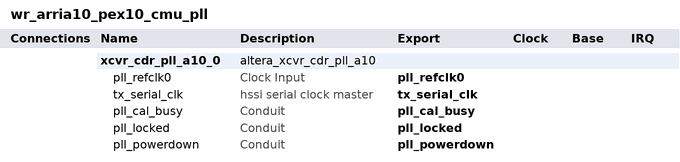
[diagram p0: system contents]
# Platform Designer (Qsys) system wr_arria10_pex10_cmu_pll, Arria 10 10AX027H2F34E2SG
# Parameters at their usual value, and those the tool derives, are not listed.
package require -exact qsys 18.1
create_system wr_arria10_pex10_cmu_pll
set_project_property DEVICE_FAMILY {Arria 10}
set_project_property DEVICE 10AX027H2F34E2SG

add_instance xcvr_cdr_pll_a10_0 altera_xcvr_cdr_pll_a10 18.1
set_instance_property xcvr_cdr_pll_a10_0 AUTO_EXPORT true
set_instance_parameter_value xcvr_cdr_pll_a10_0 base_device NIGHTFURY2
set_instance_parameter_value xcvr_cdr_pll_a10_0 bw_sel Medium
set_instance_parameter_value xcvr_cdr_pll_a10_0 cdr_pll_cgb_div 1
set_instance_parameter_value xcvr_cdr_pll_a10_0 cdr_pll_initial_settings true
set_instance_parameter_value xcvr_cdr_pll_a10_0 cdr_pll_is_cascaded_pll false
set_instance_parameter_value xcvr_cdr_pll_a10_0 cdr_pll_optimal false
set_instance_parameter_value xcvr_cdr_pll_a10_0 device_family {Arria 10}
set_instance_parameter_value xcvr_cdr_pll_a10_0 enable_analog_resets 0
set_instance_parameter_value xcvr_cdr_pll_a10_0 enable_pll_reconfig 0
set_instance_parameter_value xcvr_cdr_pll_a10_0 generate_add_hdl_instance_example 0
set_instance_parameter_value xcvr_cdr_pll_a10_0 generate_docs 0
set_instance_parameter_value xcvr_cdr_pll_a10_0 gui_tx_pll_prot_mode Basic
set_instance_parameter_value xcvr_cdr_pll_a10_0 message_level error
set_instance_parameter_value xcvr_cdr_pll_a10_0 output_clock_frequency 2500
set_instance_parameter_value xcvr_cdr_pll_a10_0 rcfg_debug 0
set_instance_parameter_value xcvr_cdr_pll_a10_0 rcfg_enable_avmm_busy_port 0
set_instance_parameter_value xcvr_cdr_pll_a10_0 rcfg_file_prefix altera_xcvr_cdr_pll_a10
set_instance_parameter_value xcvr_cdr_pll_a10_0 rcfg_h_file_enable 0
set_instance_parameter_value xcvr_cdr_pll_a10_0 rcfg_jtag_enable 0
set_instance_parameter_value xcvr_cdr_pll_a10_0 rcfg_mif_file_enable 0
set_instance_parameter_value xcvr_cdr_pll_a10_0 rcfg_separate_avmm_busy 0
set_instance_parameter_value xcvr_cdr_pll_a10_0 rcfg_sv_file_enable 0
set_instance_parameter_value xcvr_cdr_pll_a10_0 rcfg_txt_file_enable 0
set_instance_parameter_value xcvr_cdr_pll_a10_0 refclk_cnt 1
set_instance_parameter_value xcvr_cdr_pll_a10_0 refclk_index 0
set_instance_parameter_value xcvr_cdr_pll_a10_0 refclk_select_mux_powerdown_mode powerup
set_instance_parameter_value xcvr_cdr_pll_a10_0 reference_clock_frequency 125.0
set_instance_parameter_value xcvr_cdr_pll_a10_0 select_manual_config false
set_instance_parameter_value xcvr_cdr_pll_a10_0 set_altera_xcvr_cdr_pll_a10_calibration_en 1
set_instance_parameter_value xcvr_cdr_pll_a10_0 set_capability_reg_enable 0
set_instance_parameter_value xcvr_cdr_pll_a10_0 set_csr_soft_logic_enable 0
set_instance_parameter_value xcvr_cdr_pll_a10_0 set_user_identifier 0
set_instance_parameter_value xcvr_cdr_pll_a10_0 support_mode user_mode

# exported interfaces
add_interface pll_cal_busy conduit end
set_interface_property pll_cal_busy EXPORT_OF xcvr_cdr_pll_a10_0.pll_cal_busy
add_interface pll_locked conduit end
set_interface_property pll_locked EXPORT_OF xcvr_cdr_pll_a10_0.pll_locked
add_interface pll_powerdown conduit end
set_interface_property pll_powerdown EXPORT_OF xcvr_cdr_pll_a10_0.pll_powerdown
add_interface pll_refclk0 clock sink
set_interface_property pll_refclk0 EXPORT_OF xcvr_cdr_pll_a10_0.pll_refclk0
add_interface tx_serial_clk hssi_serial_clock start
set_interface_property tx_serial_clk EXPORT_OF xcvr_cdr_pll_a10_0.tx_serial_clk

set_interconnect_requirement {$system} qsys_mm.clockCrossingAdapter HANDSHAKE
set_interconnect_requirement {$system} qsys_mm.enableEccProtection FALSE
set_interconnect_requirement {$system} qsys_mm.insertDefaultSlave FALSE
set_interconnect_requirement {$system} qsys_mm.maxAdditionalLatency 1

save_system wr_arria10_pex10_cmu_pll.qsys
